# EasyEDA schematic 4.12.json
TITLE: Sheet_1; REV: 1.0; Date: 2020-11-17; Sheet: 1/1; Drawn By: Gökbey Keskin; Company: Your Company
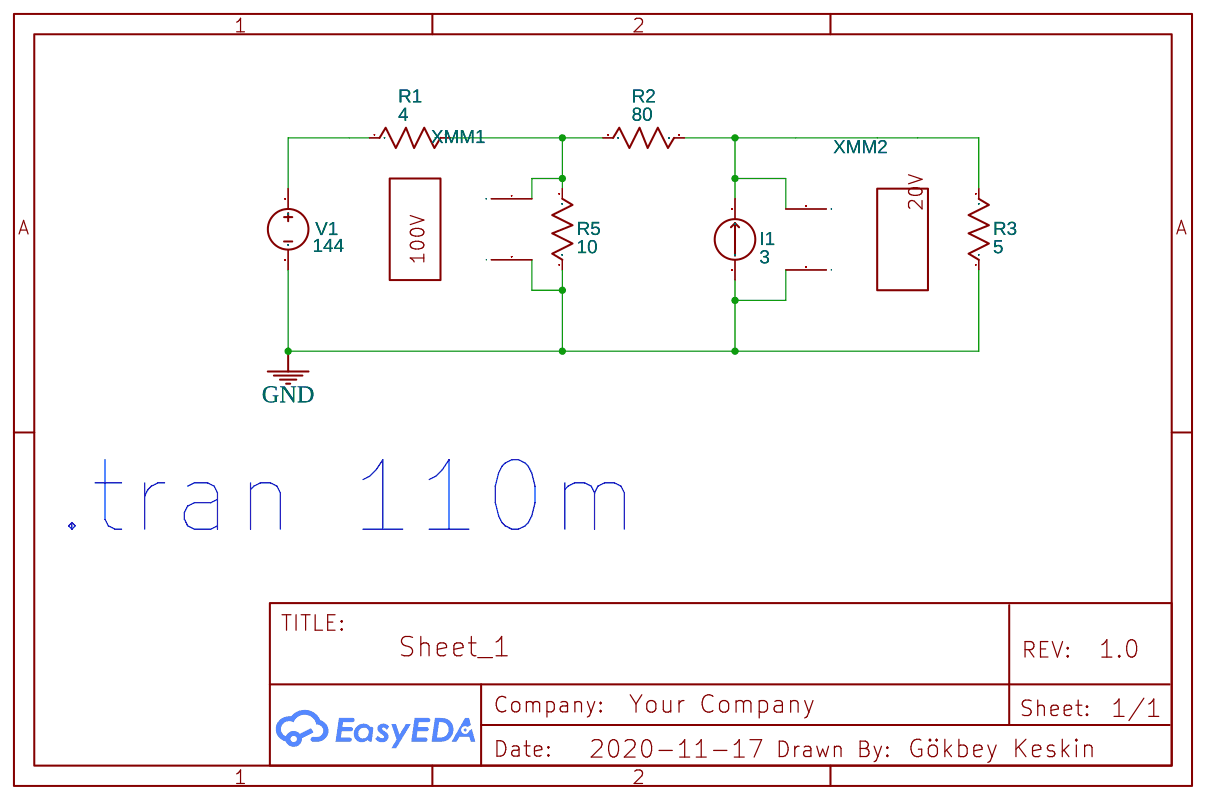
[diagram p0: schematic sheet]

## Parts
I1  3  [2P-5.08]
R1  4  [AXIAL-0.3]
R2  80  [AXIAL-0.3]
R3  5  [AXIAL-0.3]
R5  10  [AXIAL-0.3]
V1  144  [HDR1X2]
XMM1  Multimeter
XMM2  Multimeter

## Library data of the parts
I1 = IDC: Contributor: EasyEDA; sim: true
R1-R3 R5 = Resistor_US: Resistance: 1k; Contributor: EasyEDA; Supplier: YUJING
V1 = VDC: Contributor: EasyEDA; sim: true
XMM1 XMM2 = MULTIMETER: Supplier: LCSC; Multimeter Type: Voltmeter; Power Type: AC; Voltmeter resistance: 10μ; Ammeter resistance: 1G; NameDisplay: 0; Contributor: EasyEDA; sim: true

## Nets
GND: I1.1 R3.1 R5.1 V1.2 XMM1.2(I) XMM2.2(I)
Net-(I1-2): I1.2 R2.2 R3.2 XMM2.1(+)
Net-(R1-1): R1.1 V1.1
Net-(R1-2): R1.2 R2.1 R5.2 XMM1.1(+)

## Notes on the sheet
- .tran 110m
